# EAGLE design mobo_v0.2_6-20-18 (EAGLE 6.6.0)
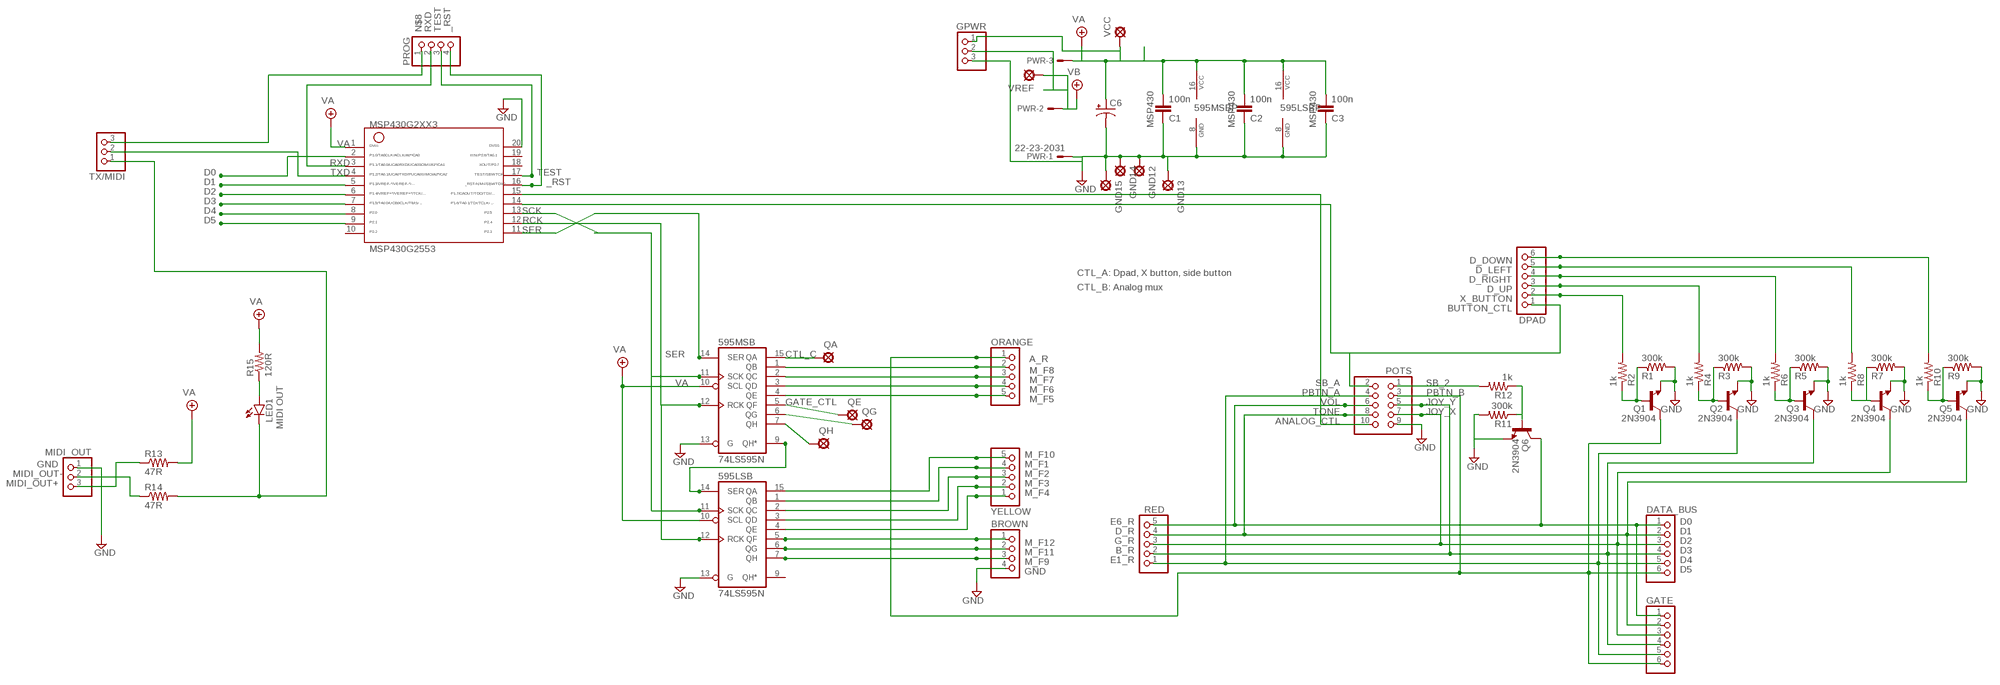
[diagram p0: schematic, sheet 1]

## Parts
595LSB  74LS595N  [DIL16]
595MSB  74LS595N  [DIL16]
BROWN  PINHD-1X4  [1X04]
C1  100n  050X030_050  [050X030_050_3]
C2  100n  050X030_0501  [050X030_050_1]
C3  100n  050X030_0501  [050X030_050_1]
C6  0501  [050_020_1]
DATA_BUS  PINHD-1X6  [1X06]
DPAD  PINHD-1X6  [1X06]
GATE  PINHD-1X6  [1X06]
GND12  PAD  [SQUARE]
GND13  PAD  [SQUARE]
GND14  PAD  [SQUARE]
GND15  PAD  [SQUARE]
GPWR  PINHD-1X3  [1X03]
LED1  LED3MM  [LED3MM]
MIDI_OUT  PINHD-1X3  [1X03]
MSP430G2553  G2XX3---N20  [N20]
ORANGE  PINHD-1X5  [1X05]
POTS  PINHD-2X5IDC  [10PIN_IDC]
PROG  PINHD-1X4  [1X04]
PWR  22-23-2031  [22-23-2031]
Q1  2N3904  [TO92-]
Q2  2N3904  [TO92-]
Q3  2N3904  [TO92-]
Q4  2N3904  [TO92-]
Q5  2N3904  [TO92-]
Q6  2N3904  [TO92-]
QA  PAD  [SQUARE]
QE  PAD  [SQUARE]
QG  PAD  [SQUARE]
QH  PAD  [SQUARE]
R1  300k  6MM.3  [R0207/3]
R2  1k  6MM.3  [R0207/3]
R3  300k  6MM.3  [R0207/3]
R4  1k  6MM.3  [R0207/3]
R5  300k  6MM.3  [R0207/3]
R6  1k  6MM.3  [R0207/3]
R7  300k  6MM.3  [R0207/3]
R8  1k  6MM.3  [R0207/3]
R9  300k  6MM.3  [R0207/3]
R10  1k  6MM.3  [R0207/3]
R11  300k  6MM.3  [R0207/3]
R12  1k  6MM.3  [R0207/3]
R13  47R  6MM.3  [R0207/3]
R14  47R  6MM.3  [R0207/3]
R15  120R  6MM.3  [R0207/3]
RED  PINHD-1X5  [1X05]
TX/MIDI  PINHD-1X3  [1X03]
VCC  PAD  [SQUARE]
VREF  PAD  [SQUARE]
YELLOW  PINHD-1X5  [1X05]

## Nets
_RST: MSP430G2553.16 PROG.4
ANALOG_CTL: MSP430G2553.15 POTS.10
BUTTON_CTL: DPAD.1 MSP430G2553.14 POTS.2
CTL_C: 595MSB.15(QA) QA.1(PAD)
D0: DATA_BUS.1 GATE.1 MSP430G2553.2 POTS.6 Q6.1(C) RED.5
D1: DATA_BUS.2 GATE.2 MSP430G2553.5 POTS.8 Q5.1(C) RED.4
D2: DATA_BUS.3 GATE.3 MSP430G2553.6 POTS.7 Q4.1(C) RED.3
D3: DATA_BUS.4 GATE.4 MSP430G2553.7 POTS.5 Q3.1(C) RED.2
D4: DATA_BUS.5 GATE.5 MSP430G2553.8 POTS.4 Q2.1(C) RED.1
D5: DATA_BUS.6 GATE.6 MSP430G2553.9 ORANGE.1 POTS.3 Q1.1(C)
D_DOWN: DPAD.6 R10.2
D_LEFT: DPAD.5 R8.2
D_RIGHT: DPAD.4 R6.2
D_UP: DPAD.3 R4.2
GATE_CTL: 595MSB.5(QF) QE.1(PAD)
GND: 595LSB.8(GND) 595LSB.13(G) 595MSB.8(GND) 595MSB.13(G) BROWN.4 C1.1 C2.1 C3.1 C6.- GND12.1(PAD) GND13.1(PAD) GND14.1(PAD) GND15.1(PAD) GPWR.3 MIDI_OUT.1 MSP430G2553.20 POTS.9 PWR.1 Q1.3(E) Q2.3(E) Q3.3(E) Q4.3(E) Q5.3(E) Q6.3(E) R1.2 R3.2 R5.2 R7.2 R9.2 R11.2
M_F1: 595LSB.1(QB) YELLOW.4
M_F2: 595LSB.2(QC) YELLOW.3
M_F3: 595LSB.3(QD) YELLOW.2
M_F4: 595LSB.4(QE) YELLOW.1
M_F5: 595MSB.4(QE) ORANGE.5
M_F6: 595MSB.3(QD) ORANGE.4
M_F7: 595MSB.2(QC) ORANGE.3
M_F8: 595MSB.1(QB) ORANGE.2
M_F9: 595LSB.7(QH) BROWN.3
M_F10: 595LSB.15(QA) YELLOW.5
M_F11: 595LSB.6(QG) BROWN.2
M_F12: 595LSB.5(QF) BROWN.1
MIDI_OUT+: MIDI_OUT.3 R13.1
MIDI_OUT-: MIDI_OUT.2 R14.1
N$1: Q6.2(B) R11.1 R12.1
N$2: 595LSB.14(SER) 595MSB.9(QH*)
N$3: 595MSB.6(QG) QG.1(PAD)
N$4: 595MSB.7(QH) QH.1(PAD)
N$6: LED1.A R15.1
N$7: LED1.K(C) R14.2 TX/MIDI.1
N$8: PROG.1 TX/MIDI.3
N$13: Q1.2(B) R1.1 R2.1
N$14: Q2.2(B) R3.1 R4.1
N$15: Q3.2(B) R5.1 R6.1
N$16: Q4.2(B) R7.1 R8.1
N$17: Q5.2(B) R9.1 R10.1
RCK: 595LSB.12(RCK) 595MSB.12(RCK) MSP430G2553.12
RXD: MSP430G2553.3 PROG.2
SB_2: POTS.1 R12.2
SCK: 595LSB.11(SCK) 595MSB.11(SCK) MSP430G2553.13
SER: 595MSB.14(SER) MSP430G2553.11
TEST: MSP430G2553.17 PROG.3
TXD: MSP430G2553.4 TX/MIDI.2
VA: 595LSB.10(SCL) 595LSB.16(VCC) 595MSB.10(SCL) 595MSB.16(VCC) C1.2 C2.2 C3.2 C6.+ GPWR.1 MSP430G2553.1 PWR.3 R13.2 R15.2 VCC.1(PAD)
VB: GPWR.2 PWR.2 VREF.1(PAD)
X_BUTTON: DPAD.2 R2.2
Unconnected: 595LSB.9(QH*) MSP430G2553.10 MSP430G2553.18 MSP430G2553.19

## Notes on the sheet
- MSP430 | MSP430 | MSP430
- CTL_A: Dpad, X button, side button
- CTL_B: Analog mux
- A_R
- SB_A
- PBTN_A | PBTN_B
- VOL | JOY_Y
- TONE | JOY_X
- MIDI OUT
- E6_R
- D_R
- G_R
- B_R
- E1_R

## Library data of the parts
595LSB 595MSB = 74xx-us:74*595: 8-bit SHIFT REGISTER, output latch
BROWN PROG = pinhead:PINHD-1X4: PIN HEADER
C1-C3 = gm-caps-ceramic:050X030_050: 120 - 150pF Xicon Ceramic Disc 5mm lead spacing
C6 = gm-caps-electro-pol:050: 0.22 - 100uF Xicon values at Mouser.com: 10V: 10 - 100uF; 16V: 2.2 - 47uF; 25V: 0.47 - 47uF; 50V: 0.22 - 22uF
DATA_BUS DPAD GATE = pinhead:PINHD-1X6: PIN HEADER
GND12-GND15 QA QE QG QH VCC VREF = gm-supply:PAD: PAD use this package for pads with any purpose, including input, output, send or return various pad shapes: round, square, octogonal, long, and long offset
GPWR MIDI_OUT TX/MIDI = pinhead:PINHD-1X3: PIN HEADER
LED1 = gm-diodes:LED
MSP430G2553 = TI_MSP430_v16:G2XX3---N20: MSP430G2XX1 PDIP (N) 20 Pin Package
ORANGE RED YELLOW = pinhead:PINHD-1X5: PIN HEADER
POTS = jaapie:PINHD-2X5: PIN HEADER
PWR = jaapie:22-23-2031: .100" (2.54mm) Center Header - 3 Pin; MF: MOLEX; MPN: 22-23-2031; OC_FARNELL: 1462950; OC_NEWARK: 30C0862
Q1-Q6 = gm-trans:2N3904: NPN Transistor
R1-R15 = gm-resistors:6MM: 6mm Resistors Leads spaced 1-6 holes apart for 0.1" perfboard. Suitable for 1/4 watt resistors.

## Board
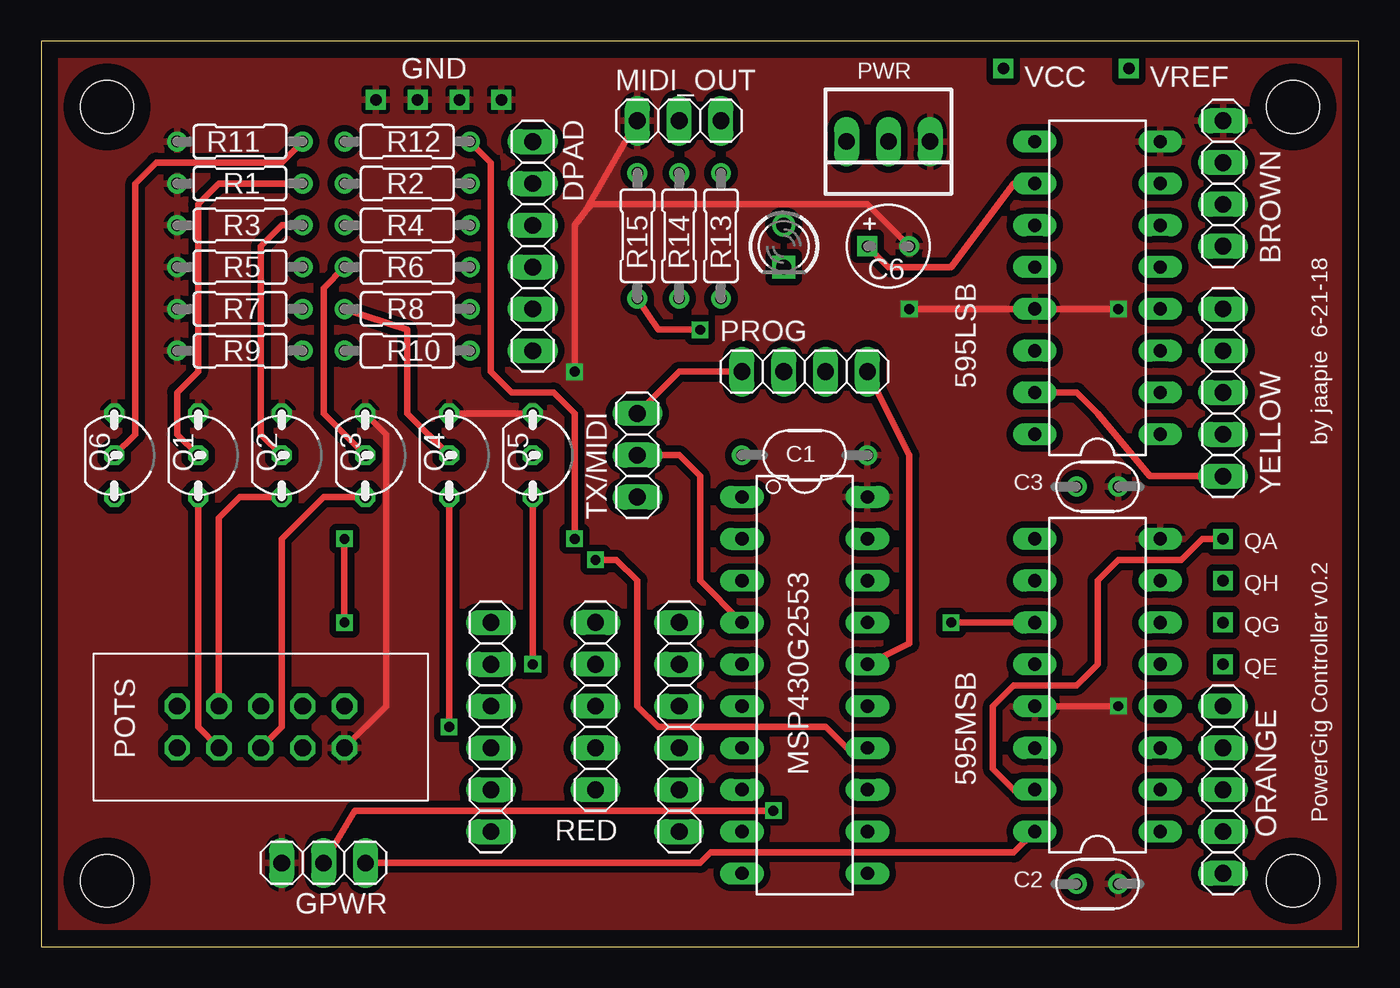
[diagram p1: board, top side]
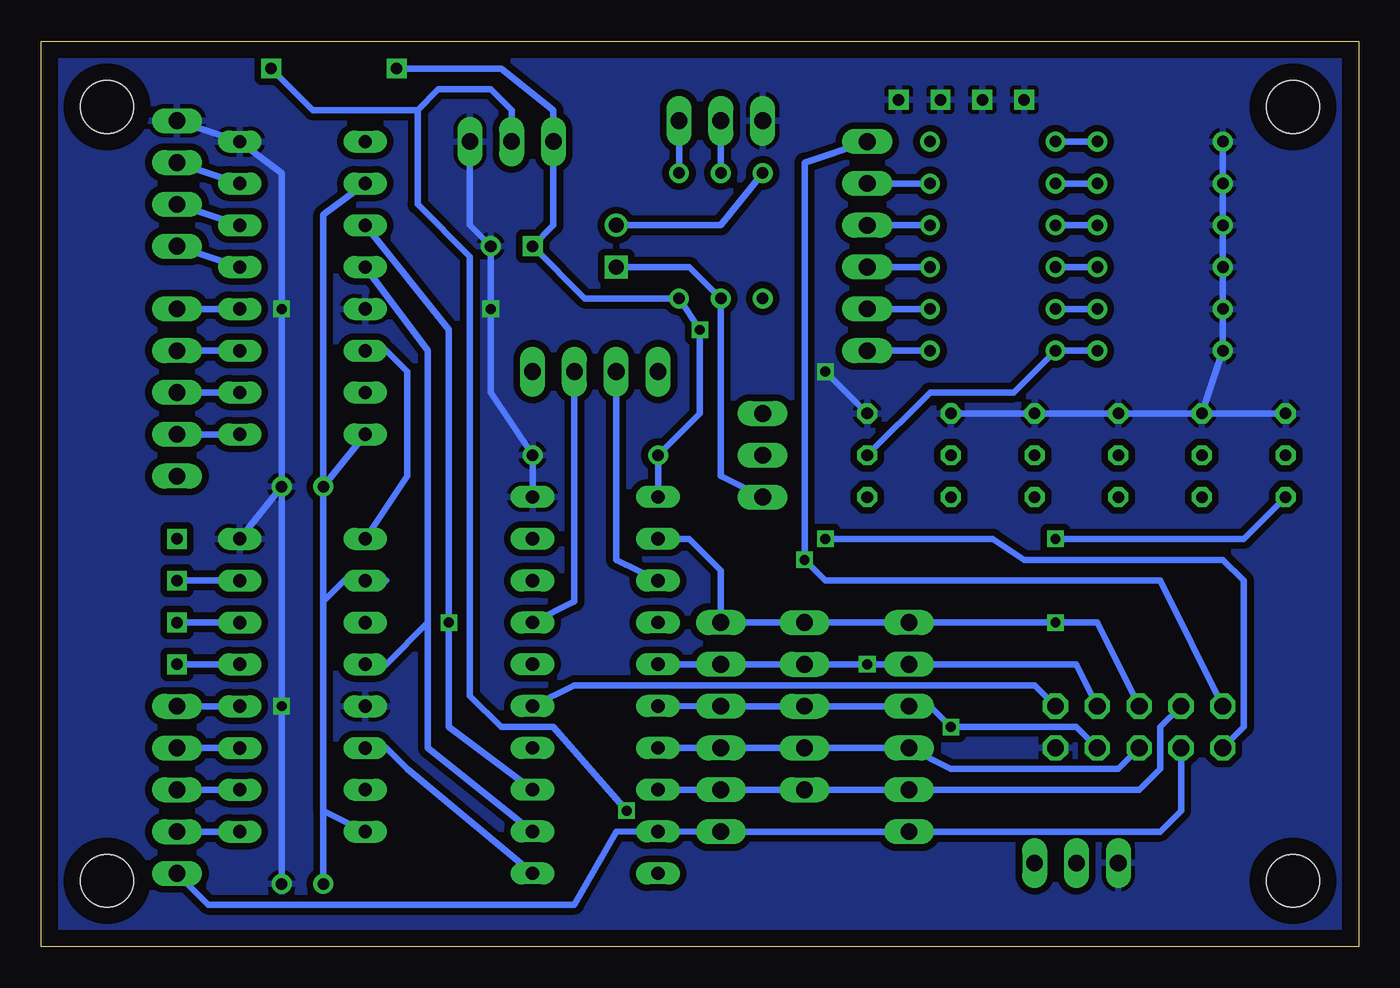
[diagram p2: board, bottom side, seen from below]

Size 80 x 55 mm. Coordinates in mm from the lower left corner, seen from the top.
Outline: 0,0 80,0 80,55 0,55 0,0
Copper layers (1*16): Top 0.035mm / dielectric 1.5mm / Bottom 0.035mm
Design rules "default": minimum track width 10mil, minimum drill 24mil, track to track 8mil, track to pad 8mil, pad to pad 8mil, via to via 8mil, smd to smd 8mil, copper to edge 40mil, drill to drill 8mil, minimum pad ring 10mil, minimum via ring 8mil, stop-mask expansion 4mil, vias tented up to drill 0mil, thermal gap 10mil
Holes 3.2 mm at 4,4 4,51 76,51 76,4

### Footprints (pad centres in the part's own frame; a part is rotated, then mirrored left to right if it is on the bottom)
DIL16 = drill 0.813 long: 1 -8.89,-3.81; 2 -6.35,-3.81; 3 -3.81,-3.81; 4 -1.27,-3.81; 5 1.27,-3.81; 6 3.81,-3.81; 7 6.35,-3.81; 8 8.89,-3.81; 9 8.89,3.81; 10 6.35,3.81; 11 3.81,3.81; 12 1.27,3.81; 13 -1.27,3.81; 14 -3.81,3.81; 15 -6.35,3.81; 16 -8.89,3.81
1X04 = drill 1.016 long: 1 -3.81,0; 2 -1.27,0; 3 1.27,0; 4 3.81,0
050X030_050_3 = drill 0.7: 1 -3.81,0; 2 3.81,0
050X030_050_1 = drill 0.7: 1 -1.27,0; 2 1.27,0
050_020_1 = drill 0.7 square: + -1.27,0 | drill 0.7: - 1.27,0
1X06 = drill 1.016 long: 1 -6.35,0; 2 -3.81,0; 3 -1.27,0; 4 1.27,0; 5 3.81,0; 6 6.35,0
SQUARE = drill 0.7 square: 1 0,0
1X03 = drill 1.016 long: 1 -2.54,0; 2 0,0; 3 2.54,0
LED3MM = drill 0.9: A -1.27,0 | drill 0.9 square: K 1.27,0
N20 = drill 0.813 long: 1 -11.435,-3.81; 2 -8.895,-3.81; 3 -6.355,-3.81; 4 -3.815,-3.81; 5 -1.275,-3.81; 6 1.265,-3.81; 7 3.805,-3.81; 8 6.345,-3.81; 9 8.885,-3.81; 10 11.425,-3.81; 11 11.425,3.81; 12 8.885,3.81; 13 6.345,3.81; 14 3.805,3.81; 15 1.265,3.81; 16 -1.275,3.81; 17 -3.815,3.81; 18 -6.355,3.81; 19 -8.895,3.81; 20 -11.435,3.81
1X05 = drill 1.016 long: 1 -5.08,0; 2 -2.54,0; 3 0,0; 4 2.54,0; 5 5.08,0
10PIN_IDC = drill 1.016 octagon: 1 -5.08,-1.27; 2 -5.08,1.27; 3 -2.54,-1.27; 4 -2.54,1.27; 5 0,-1.27; 6 0,1.27; 7 2.54,-1.27; 8 2.54,1.27; 9 5.08,-1.27; 10 5.08,1.27
22-23-2031 = drill 1 long: 1 -2.54,0; 2 0,0; 3 2.54,0
TO92- = drill 0.7 octagon: 1 2.54,0; 2 0,0; 3 -2.54,0
R0207/3 = drill 0.7: 1 -3.81,0; 2 3.81,0

### Placement (x,y rotation side)
595LSB  64.14,40.01 90 top
595MSB  64.14,15.88 90 top
BROWN  71.75,46.35 90 top
C1  46.35,29.84 180 top
C2  64.14,3.81 180 top
C3  64.14,27.94 180 top
C6  51.44,42.55 0 top
DATA_BUS  38.73,13.34 270 top
DPAD  29.84,42.55 270 top
GATE  27.3,13.34 270 top
GND12  20.32,51.44 90 top
GND13  27.94,51.44 90 top
GND14  25.4,51.44 90 top
GND15  22.86,51.44 90 top
GPWR  17.14,5.08 180 top
LED1  45.09,42.55 270 top
MIDI_OUT  38.73,50.16 0 top
MSP430G2553  46.35,15.88 270 top
ORANGE  71.75,9.53 90 top
POTS  13.34,13.34 0 top
PROG  46.35,34.92 0 top
PWR  51.44,48.9 180 top
Q1  9.53,29.84 270 top
Q2  14.61,29.84 270 top
Q3  19.68,29.84 270 top
Q4  24.77,29.84 270 top
Q5  29.84,29.84 270 top
Q6  4.45,29.84 270 top
QA  71.75,24.77 0 top
QE  71.75,17.14 0 top
QG  71.75,19.68 0 top
QH  71.75,22.23 0 top
R1  12.06,46.35 180 top
R2  22.23,46.35 0 top
R3  12.06,43.81 180 top
R4  22.23,43.81 0 top
R5  12.06,41.27 180 top
R6  22.23,41.27 0 top
R7  12.06,38.73 180 top
R8  22.23,38.73 0 top
R9  12.06,36.2 180 top
R10  22.23,36.2 0 top
R11  12.06,48.9 180 top
R12  22.23,48.9 0 top
R13  41.27,43.18 270 top
R14  38.73,43.18 270 top
R15  36.2,43.18 270 top
RED  33.66,14.61 90 top
TX/MIDI  36.2,29.84 90 top
VCC  58.42,53.34 0 top
VREF  66.04,53.34 0 top
YELLOW  71.75,33.66 270 top

### Tracks (layer width: path | path; a pad name or v marks a point on that pad's centre or on a via)
_RST
  Top 0.406: MSP430G2553.16 52.7,18.41 52.7,29.84 PROG.4
ANALOG_CTL
  Bottom 0.406: POTS.10 19.68,15.88 47.62,15.88 MSP430G2553.15
BUTTON_CTL  (via drill 0.6)
  Top 0.406: MSP430G2553.14 48.9,12.06 47.62,13.34 37.47,13.34 36.2,14.61 36.2,22.23 34.92,23.5 v33.66,23.5
  Bottom 0.406: POTS.2 12.06,22.23 32.38,22.23 v33.66,23.5 33.66,47.62 DPAD.1
CTL_C
  Top 0.406: 595MSB.15 59.05,9.53 57.78,10.79 57.78,14.61 59.05,15.88 62.87,15.88 64.14,17.14 64.14,22.23 65.41,23.5 69.22,23.5 70.48,24.77 QA.1
D0  (via drill 0.6)
  Top 0.406: v18.41,24.77 v18.41,19.68
  Bottom 0.406: MSP430G2553.2 40.64,24.77 38.73,22.86 DATA_BUS.1 RED.5 GATE.1 v18.41,19.68 15.88,19.68 POTS.6 | Q6.1 6.99,24.77 v18.41,24.77
D1  (via drill 0.6)
  Top 0.406: Q5.1 v29.84,17.14
  Bottom 0.406: POTS.8 17.14,17.14 GATE.2 v29.84,17.14 RED.4 DATA_BUS.2 40.01,17.14 MSP430G2553.5
D2  (via drill 0.6)
  Top 0.406: Q4.1 v24.77,13.34
  Bottom 0.406: POTS.7 17.14,13.34 v24.77,13.34 26.04,14.61 GATE.3 RED.3 DATA_BUS.3 MSP430G2553.6
D3
  Top 0.406: POTS.5 14.61,13.34 14.61,24.77 17.14,27.3 Q3.1
  Bottom 0.406: POTS.5 14.61,10.79 24.77,10.79 GATE.4 RED.2 DATA_BUS.4 MSP430G2553.7
D4
  Top 0.406: POTS.4 10.79,26.04 12.06,27.3 Q2.1
  Bottom 0.406: POTS.4 12.06,13.34 12.06,10.79 13.34,9.53 GATE.5 RED.1 DATA_BUS.5 MSP430G2553.8
D5
  Top 0.406: POTS.3 9.53,13.34 Q1.1
  Bottom 0.406: MSP430G2553.9 43.82,6.99 | ORANGE.1 69.85,2.54 47.62,2.54 45.09,6.99 MSP430G2553.9 | POTS.3 10.79,8.26 12.06,6.99 GATE.6 DATA_BUS.6 MSP430G2553.9
D_DOWN
  Bottom 0.406: DPAD.6 R10.2
D_LEFT
  Bottom 0.406: DPAD.5 R8.2
D_RIGHT
  Bottom 0.406: DPAD.4 R6.2
D_UP
  Bottom 0.406: DPAD.3 R4.2
GATE_CTL
  Bottom 0.406: 595MSB.5 QE.1
GND  (via drill 0.6)
  Top 0.406: 595MSB.13 v65.41,14.61 | v65.41,38.73 595LSB.13 v52.7,38.73 | Q5.3 Q4.3 | POTS.9 20.95,14.61 20.95,31.11 Q3.3 | v32.38,34.92 32.38,43.81 32.99,44.63 | 32.99,44.63 MIDI_OUT.1 | C6.- 50.16,45.09 33.45,45.09 32.99,44.63
  Bottom 0.406: BROWN.4 595LSB.8 65.41,46.99 v65.41,38.73 C3.1 | 595MSB.8 C3.1 | C2.1 v65.41,14.61 C3.1 | MSP430G2553.20 C1.1 52.7,33.66 v52.7,38.73 C6.- 53.98,43.81 PWR.1 | Q4.3 Q3.3 Q2.3 Q1.3 | Q1.3 R9.2 R7.2 R5.2 R3.2 R1.2 R11.2 | Q6.3 Q1.3 | Q5.3 v32.38,34.92
  pour Bottom (isolate 0.406): 0,0 0,55 80,55 80,0
  pour Top (isolate 0.406): 0,0 0,55 80,55 80,0
M_F1
  Bottom 0.406: YELLOW.4 595LSB.1
M_F2
  Bottom 0.406: 595LSB.2 YELLOW.3
M_F3
  Bottom 0.406: YELLOW.2 595LSB.3
M_F4
  Bottom 0.406: 595LSB.4 YELLOW.1
M_F5
  Bottom 0.406: 595MSB.4 ORANGE.5
M_F6
  Bottom 0.406: ORANGE.4 595MSB.3
M_F7
  Bottom 0.406: ORANGE.3 595MSB.2
M_F8
  Bottom 0.406: ORANGE.2 595MSB.1
M_F9
  Bottom 0.406: BROWN.3 595LSB.7
M_F10
  Top 0.406: 595LSB.15 62.87,33.66 64.14,32.38 67.31,28.57 YELLOW.5
M_F11
  Bottom 0.406: 595LSB.6 BROWN.2
M_F12
  Bottom 0.406: BROWN.1 595LSB.5
MIDI_OUT+
  Bottom 0.406: MIDI_OUT.3 R13.1
MIDI_OUT-
  Bottom 0.406: MIDI_OUT.2 R14.1
N$1
  Top 0.406: Q6.2 5.71,31.11 5.71,46.35 6.99,47.62 14.61,47.62 R11.1
  Bottom 0.406: R12.1 R11.1
N$2
  Bottom 0.406: 595MSB.9 57.78,28.57 57.78,34.92 59.05,36.2 595LSB.14
N$3
  Bottom 0.406: 595MSB.6 QG.1
N$4
  Bottom 0.406: 595MSB.7 QH.1
N$6
  Bottom 0.406: LED1.A 38.73,43.81 R15.1
N$7
  Bottom 0.406: TX/MIDI.1 38.73,28.57 R14.2 40.64,41.27 LED1.K
N$8
  Top 0.406: TX/MIDI.3 38.73,34.92 PROG.1
N$13
  Top 0.406: R1.1 10.79,46.35 9.53,45.09 9.53,34.92 8.26,33.66 8.26,31.11 Q1.2
  Bottom 0.406: R1.1 R2.1
N$14
  Top 0.406: R3.1 14.61,43.81 13.34,42.55 13.34,31.11 Q2.2
  Bottom 0.406: R3.1 R4.1
N$15
  Top 0.406: R6.1 17.14,40.01 17.14,32.38 Q3.2
  Bottom 0.406: R5.1 R6.1
N$16
  Top 0.406: R8.1 22.23,37.47 22.23,32.38 Q4.2
  Bottom 0.406: R7.1 R8.1
N$17
  Bottom 0.406: R9.1 R10.1 20.95,33.66 26.04,33.66 Q5.2
RCK
  Bottom 0.406: 595MSB.12 59.05,17.14 56.52,19.68 | 595LSB.12 56.52,36.2 56.52,19.68 | 56.52,19.68 56.52,12.06 MSP430G2553.12
RXD
  Bottom 0.406: MSP430G2553.3 45.09,23.5 PROG.2
SB_2  (via drill 0.6)
  Top 0.406: R12.2 27.3,47.62 27.3,34.92 28.57,33.66 31.11,33.66 32.38,32.38 v32.38,24.77
  Bottom 0.406: v32.38,24.77 22.23,24.77 20.32,23.5 8.26,23.5 6.99,22.23 6.99,13.34 POTS.1
SCK  (via drill 0.6)
  Top 0.406: 595MSB.11 v55.24,19.68
  Bottom 0.406: 595LSB.11 55.24,37.47 v55.24,19.68 55.24,13.34 MSP430G2553.13
SER
  Bottom 0.406: 595MSB.14 59.05,12.06 57.78,10.79 MSP430G2553.11
TEST
  Bottom 0.406: PROG.3 47.62,20.95 MSP430G2553.17
TXD
  Top 0.406: TX/MIDI.2 38.73,29.84 40.01,28.57 40.01,22.23 MSP430G2553.4
VA  (via drill 0.6)
  Top 0.406: v40.01,37.47 37.47,37.47 R15.2 | C6.+ 51.44,41.27 55.24,41.27 59.05,46.35 595LSB.10 | 595MSB.16 59.05,5.71 40.64,5.71 40.01,5.08 GPWR.1
  Bottom 0.406: 595MSB.16 62.87,8.26 | 62.87,8.26 62.87,20.95 | 62.87,20.95 C3.2 | C3.2 62.87,44.45 595LSB.10 | 595LSB.16 C3.2 | 59.05,22.23 595MSB.10 61.59,22.23 62.87,20.95 | MSP430G2553.1 C1.2 40.01,32.38 v40.01,37.47 R13.2 46.99,39.37 C6.+ 48.9,43.81 PWR.3 48.9,50.8 52.07,53.34 VCC.1 | 62.87,8.26 C2.2
VB  (via drill 0.6)
  Top 0.406: v44.45,8.26 19.05,8.26 GPWR.2
  Bottom 0.406: PWR.2 51.44,50.8 52.7,52.07 55.88,52.07 57.15,50.8 | 57.15,50.8 57.15,45.09 53.98,41.91 53.98,15.24 52.07,13.34 48.9,13.34 v44.45,8.26 | VREF.1 63.5,50.8 57.15,50.8
X_BUTTON
  Bottom 0.406: DPAD.2 R2.2

### Text on the board
tNames: GND | by jaapie 6-21-18 | PowerGig Controller v0.2